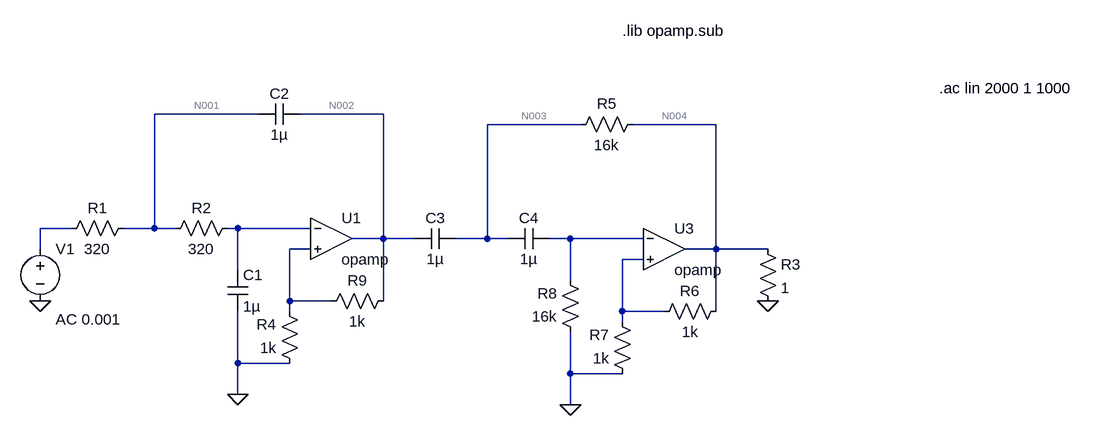
[diagram p0: schematic 2ndOrderBPF.asc]
2ndOrderBPF.asc, the LTspice schematic file:
Version 4
SHEET 1 1336 680
WIRE 64 -16 -96 -16
WIRE 256 -16 128 -16
WIRE 560 0 416 0
WIRE 768 0 640 0
WIRE -224 160 -272 160
WIRE -96 160 -96 -16
WIRE -96 160 -144 160
WIRE -64 160 -96 160
WIRE 32 160 16 160
WIRE 144 160 32 160
WIRE 256 176 256 -16
WIRE 256 176 208 176
WIRE 304 176 256 176
WIRE 416 176 416 0
WIRE 416 176 368 176
WIRE 448 176 416 176
WIRE 544 176 512 176
WIRE 656 176 544 176
WIRE -272 192 -272 160
WIRE 144 192 112 192
WIRE 768 192 768 0
WIRE 768 192 720 192
WIRE 848 192 768 192
WIRE 656 208 624 208
WIRE 32 224 32 160
WIRE 544 240 544 176
WIRE 112 272 112 192
WIRE 176 272 112 272
WIRE 256 272 256 176
WIRE 112 288 112 272
WIRE 624 288 624 208
WIRE 688 288 624 288
WIRE 768 288 768 192
WIRE 624 304 624 288
WIRE 32 368 32 288
WIRE 112 368 32 368
WIRE 544 384 544 320
WIRE 624 384 544 384
WIRE 32 416 32 368
WIRE 544 432 544 384
FLAG 32 416 0
FLAG -272 272 0
FLAG 544 432 0
FLAG 848 272 0
SYMBOL OpAmps\\opamp 176 112 R0
SYMATTR InstName U1
SYMBOL voltage -272 176 R0
WINDOW 123 24 124 Left 2
WINDOW 39 0 0 Left 0
SYMATTR InstName V1
SYMATTR Value ""
SYMATTR Value2 AC 0.001
SYMBOL res -128 144 R90
WINDOW 0 0 56 VBottom 2
WINDOW 3 32 56 VTop 2
SYMATTR InstName R1
SYMATTR Value 320
SYMBOL res 32 144 R90
WINDOW 0 0 56 VBottom 2
WINDOW 3 32 56 VTop 2
SYMATTR InstName R2
SYMATTR Value 320
SYMBOL cap 16 224 R0
SYMATTR InstName C1
SYMATTR Value 1µ
SYMBOL cap 128 -32 R90
WINDOW 0 0 32 VBottom 2
WINDOW 3 32 32 VTop 2
SYMATTR InstName C2
SYMATTR Value 1µ
SYMBOL res 128 384 R180
WINDOW 0 36 76 Left 2
WINDOW 3 36 40 Left 2
SYMATTR InstName R4
SYMATTR Value 1k
SYMBOL OpAmps\\opamp 688 128 R0
SYMATTR InstName U3
SYMBOL res 784 272 R90
WINDOW 0 0 56 VBottom 2
WINDOW 3 32 56 VTop 2
SYMATTR InstName R6
SYMATTR Value 1k
SYMBOL res 640 400 R180
WINDOW 0 36 76 Left 2
WINDOW 3 36 40 Left 2
SYMATTR InstName R7
SYMATTR Value 1k
SYMBOL res 832 176 R0
SYMATTR InstName R3
SYMATTR Value 1
SYMBOL cap 368 160 R90
WINDOW 0 0 32 VBottom 2
WINDOW 3 32 32 VTop 2
SYMATTR InstName C3
SYMATTR Value 1µ
SYMBOL cap 512 160 R90
WINDOW 0 0 32 VBottom 2
WINDOW 3 32 32 VTop 2
SYMATTR InstName C4
SYMATTR Value 1µ
SYMBOL res 656 -16 R90
WINDOW 0 0 56 VBottom 2
WINDOW 3 32 56 VTop 2
SYMATTR InstName R5
SYMATTR Value 16k
SYMBOL res 560 336 R180
WINDOW 0 36 76 Left 2
WINDOW 3 36 40 Left 2
SYMATTR InstName R8
SYMATTR Value 16k
SYMBOL res 272 256 R90
WINDOW 0 0 56 VBottom 2
WINDOW 3 32 56 VTop 2
SYMATTR InstName R9
SYMATTR Value 1k
TEXT 624 -144 Left 2 !.lib opamp.sub
TEXT 1112 -56 Left 2 !.ac lin 2000 1 1000

The netlist it stands for:
* 2ndOrderBPF.asc
XU1 N006 N008 N002 opamp Aol=100K GBW=10Meg  ; pins invin noninvin out
V1 N005 0 AC 0.001
R1 N001 N005 320
R2 N006 N001 320
C1 N006 0 1µ
C2 N002 N001 1µ
R4 0 N008 1k
XU3 N007 N009 N004 opamp Aol=100K GBW=10Meg  ; pins invin noninvin out
R6 N004 N009 1k
R7 0 N009 1k
R3 N004 0 1
C3 N003 N002 1µ
C4 N007 N003 1µ
R5 N004 N003 16k
R8 0 N007 16k
R9 N002 N008 1k
.lib opamp.sub
.ac lin 2000 1 1000
.backanno
.end

* Results of the author's LTspice run, read from the files saved beside the schematic
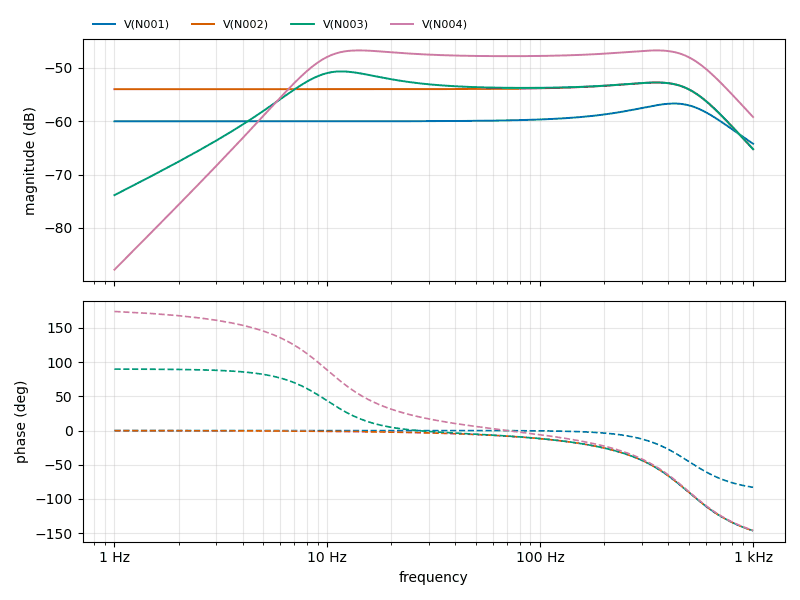
[diagram p1: AC Analysis of 2ndOrderBPF.asc, plotted from the saved traces]
* AC Analysis, 1 run:
*   V(N001): -60.00 dB at 1 Hz, -64.21 dB at 1 kHz, peak -56.67 dB at 425.8 Hz, 3 dB below the peak at 96.92 Hz and 683.9 Hz
*   V(N002): -53.98 dB at 1 Hz, -65.22 dB at 1 kHz, peak -52.73 dB at 351.8 Hz, 3 dB below the peak at 581.4 Hz
*   V(N003): -73.85 dB at 1 Hz, -65.22 dB at 1 kHz, peak -50.64 dB at 11.49 Hz, 3 dB below the peak at 7.239 Hz and 55.92 Hz
*   V(N004): -87.82 dB at 1 Hz, -59.19 dB at 1 kHz, peak -46.71 dB at 13.99 Hz, 3 dB below the peak at 8.513 Hz and 581.2 Hz